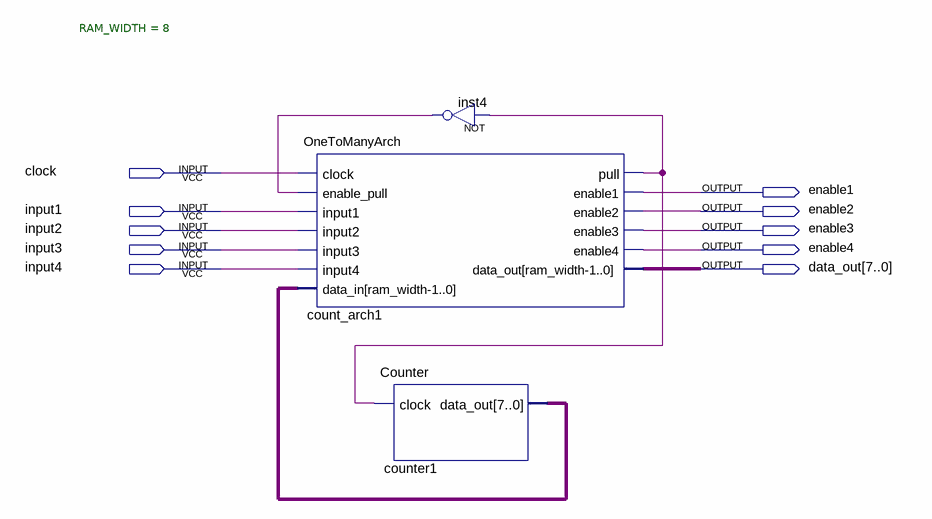
[diagram p0: schematic sheet]
// Quartus schematic MultiCounter.bdf as structural Verilog: 3 symbols, 10 pins
module MultiCounter (
  input  clock,
  input  input1,
  input  input2,
  input  input3,
  input  input4,
  output enable1,
  output enable2,
  output enable3,
  output enable4,
  output [7:0] data_out
);

  wire count_arch1_pull, inst4_out;
  wire [7:0] counter1_data_out;

  OneToManyArch #(.RAM_WIDTH(8)) count_arch1 (
    .clock(clock), .enable_pull(inst4_out), .input1(input1), .input2(input2), .input3(input3),
    .input4(input4), .data_in(counter1_data_out), .pull(count_arch1_pull), .enable1(enable1),
    .enable2(enable2), .enable3(enable3), .enable4(enable4), .data_out(data_out));
  Counter counter1 (.clock(count_arch1_pull), .data_out(counter1_data_out));
  not inst4 (inst4_out, count_arch1_pull);
endmodule
